# Altium schematic sheet AC mains Sensing.SchDoc
size A3
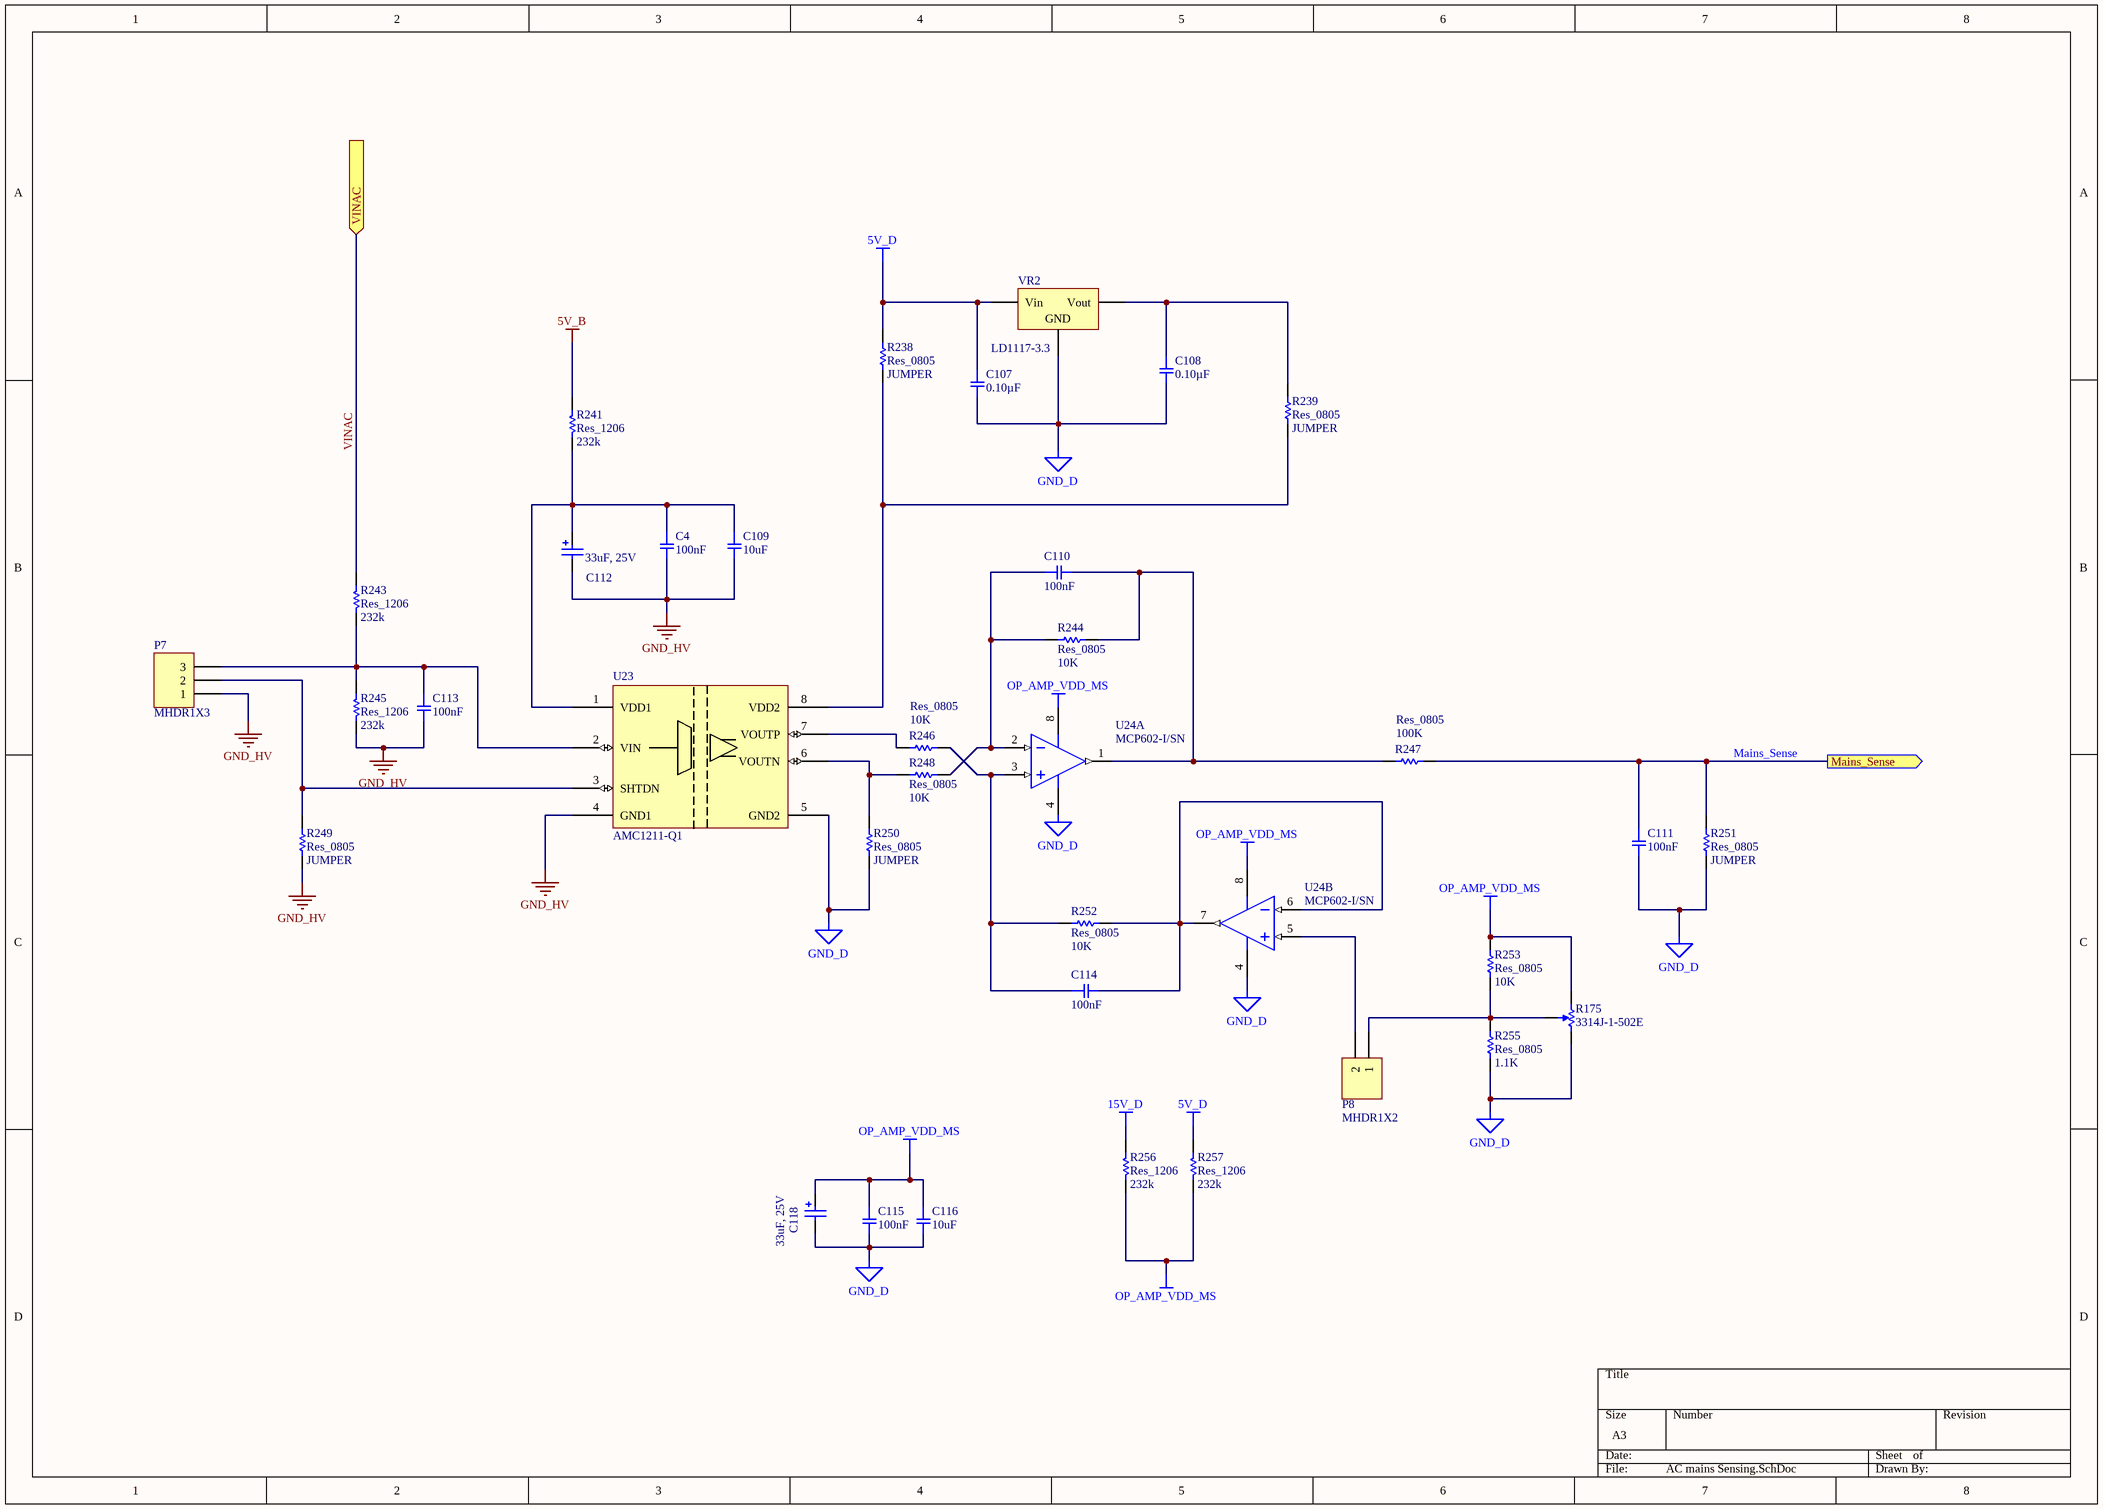
[diagram p0: AC mains Sensing.SchDoc]

## Parts
C4  100nF  [SMD-0805C]
C107  0.10µF  [SMD-0805C]
C108  0.10µF  [SMD-0805C]
C109  10uF  [SMD-0805C]
C110  100nF  [SMD-0805C]
C111  100nF  [SMD-0805C]
C112  33uF, 25V  [WCAP-ASLL_6.3x5.5]
C113  100nF  [SMD-0805C]
C114  100nF  [SMD-0805C]
C115  100nF  [SMD-0805C]
C116  10uF  [SMD-0805C]
C118  33uF, 25V  [WCAP-ASLL_6.3x5.5]
P7  MHDR1X3  [MHDR1X3]
P8  MHDR1X2  [61900211121]
R175  3314J-1-502E  [BOUR-3314J-1_V]
R238  Res_0805  value JUMPER  [WRIS-KSKE_0805_H=0.6mm]
R239  Res_0805  value JUMPER  [WRIS-KSKE_0805_H=0.6mm]
R241  Res_1206  value 232k  [WRIS-KSKE_1206_H=0.6mm]
R243  Res_1206  value 232k  [WRIS-KSKE_1206_H=0.6mm]
R244  Res_0805  value 10K  [WRIS-KSKE_0805_H=0.6mm]
R245  Res_1206  value 232k  [WRIS-KSKE_1206_H=0.6mm]
R246  Res_0805  value 10K  [WRIS-KSKE_0805_H=0.6mm]
R247  Res_0805  value 100K  [WRIS-KSKE_0805_H=0.6mm]
R248  Res_0805  value 10K  [WRIS-KSKE_0805_H=0.6mm]
R249  Res_0805  value JUMPER  [WRIS-KSKE_0805_H=0.6mm]
R250  Res_0805  value JUMPER  [WRIS-KSKE_0805_H=0.6mm]
R251  Res_0805  value JUMPER  [WRIS-KSKE_0805_H=0.6mm]
R252  Res_0805  value 10K  [WRIS-KSKE_0805_H=0.6mm]
R253  Res_0805  value 10K  [WRIS-KSKE_0805_H=0.6mm]
R255  Res_0805  value 1.1K  [WRIS-KSKE_0805_H=0.6mm]
R256  Res_1206  value 232k  [WRIS-KSKE_1206_H=0.6mm]
R257  Res_1206  value 232k  [WRIS-KSKE_1206_H=0.6mm]
U23  AMC1211-Q1  [SOIC127P570X175_HS-9N - No Thermal]
U24  MCP602-I/SN  [SOIC127P570X175_HS-9N - No Thermal]  (parts A,B of 2)
VR2  LD1117-3.3  [SOT230P700X180-4N]

## Ports
Mains_Sense (out), VINAC (in)

## Nets
5V_B: R241.2
5V_D: C107.1 R238.1 R257.2 VR2.3(Vin)
15V_D: R256.2
GND_D: C107.2 C108.2 C111.2 C115.2 C116.2 C118.1(N) R175.3 R250.2 R251.2 R255.2 U23.5(GND2) U24.4(VSS) VR2.1(GND)
GND_HV: C4.2 C109.2 C112.1(N) C113.2 P7.1 R245.1 R249.2 U23.4(GND1)
OP_AMP_VDD_MS: C115.1 C116.1 C118.2(P) R175.1 R253.1 R256.1 R257.1 U24.8(VDD)
Mains_Sense: C111.1 R247.2 R251.1 ; port Mains_Sense
VINAC: R243.2 ; port VINAC
NetC4_1: C4.1 C109.1 C112.2(P) R241.1 U23.1(VDD1)
NetC108_1: C108.1 R239.1 VR2.2(Vout)
NetC110_1: C110.1 R244.1 R248.2 U24.2(VINA-)
NetC110_2: C110.2 R244.2 R247.1 U24.1(VOUTA)
NetC113_1: C113.1 P7.3 R243.1 R245.2 U23.2(VIN)
NetC114_1: C114.1 R246.2 R252.1 U24.3(VINA+)
NetC114_2: C114.2 R252.2 U24.6(VINB-) U24.7(VOUTB)
NetP7_2: P7.2 R249.1 U23.3(SHTDN)
NetP8_1: P8.1 R175.2 R253.2 R255.1
NetP8_2: P8.2 U24.5(VINB+)
NetR238_2: R238.2 R239.2 U23.8(VDD2)
NetR246_1: R246.1 U23.7(VOUTP)
NetR248_1: R248.1 R250.1 U23.6(VOUTN)

## Library data of the parts
C4 C109-C111 C113-C116 = GC321AD72E103KX01D: CAP CER 10000PF 250V X7T 0805; Manufacturer: Murata Electronics North America; Factory Stock: 0; Unit Price (USD): 0.3; Minimum Quantity: 1; Tolerance: ±10%; Datasheets: http://search.murata.co.jp/Ceramy/image/img/A01X/G101/ENG/GC321AD72E103KX01-01.pdf; Image: //media.digikey.com/Renders/Murata%20Renders/0805(GC3)200x125.jpg; Digi-Key Part Number: 490-13986-1-ND; Part Number: GC321AD72E103KX01D; Quantity Available: 4000; @ qty: 0; Packaging: Cut Tape (CT); Series: GC3; Part Status: Active; Voltage: 250V; Temperature Coefficient: X7T; Operating Temperature: -55°C ~ 125°C; Features: -; Ratings: AEC-Q200; Applications: Automotive; Mounting Type: Surface Mount, MLCC; Package / Case: 0805 (2012 Metric); Size / Dimension: 0.079" L x 0.049" W (2.00mm x 1.25mm); Height - Seated (Max): -; Thickness (Max): 0.039" (1.00mm); Lead Spacing: -; Lead Style: -
  C4 C110 C111 C113-C115: Value: 100nF
  C109 C116: Value: 10uF
C107 C108 = GCD21BR71H104KA01L: CAP CER 0.1UF 50V X7R 0805; Manufacturer: Murata Electronics North America; Factory Stock: 0; Unit Price (USD): 0.24; Minimum Quantity: 1; Tolerance: ±10%; Datasheets: http://www.murata.com/~/media/webrenewal/support/library/catalog/products/capacitor/mlcc/c03e.ashx; Image: //media.digikey.com/Renders/Murata%20Renders/0805%28GxM6%29.jpg; Digi-Key Part Number: 490-11955-1-ND; Part Number: GCD21BR71H104KA01L; Quantity Available: 157; @ qty: 0; Packaging: Cut Tape (CT); Series: GCD; Part Status: Active; Value: 0.10µF; Voltage: 50V; Temperature Coefficient: X7R; Operating Temperature: -55°C ~ 125°C; Features: -; Ratings: AEC-Q200; Applications: Automotive; Mounting Type: Surface Mount, MLCC; Package / Case: 0805 (2012 Metric); Size / Dimension: 0.079" L x 0.049" W (2.00mm x 1.25mm); Height - Seated (Max): -; Thickness (Max): 0.049" (1.25mm); Lead Spacing: -; Lead Style: -
C112 C118 = 865060443003: WCAP-ASLL SMT Aluminum Electrolytic Capacitors, D6.3mm x L5.5mm, 33uF, +/-20%, 25VDC; Dissipation Factor: 14%; Endurance: 2000h; Leakage Current: 8.25uA; Ripple Current max.: 230mA; Technical Reference: ASED055330M025DVCTBB000; ComponentLink1Description: Manufacturer; ComponentLink1URL: http://www.we-online.de; ComponentLink2Description: Datasheet; ComponentLink2URL: https://katalog.we-online.com/pbs/datasheet/865060443003.pdf; Length: 5.5mm; Mounting Technology: SMT; Operating Temperature: -55 to +105degC; Packaging: Tape and Reel; Published Date: August 2019; Capacitance: 33uF; Diameter: 6.3mm; Part Number: 865060443003; Publisher: Wurth Elektronik; Capacitance Tolerance: +/-20%; Rated Voltage: 25VDC
P7 = MHDR1X3: Header, 3-Pin; LatestRevisionDate: 17-Jul-2002; LatestRevisionNote: Re-released for DXP Platform.; Publisher: Altium Limited
P8 = MHDR1X2: Header, 2-Pin; LatestRevisionDate: 17-Jul-2002; LatestRevisionNote: Re-released for DXP Platform.; Publisher: Altium Limited
R175 = CMP-2000-05590-1: 4 mm Square Trimpot(R) Trimming Potentiometer, 5 KOhm, +/- 20%, 0.25 W, -55 to 125 degC, 3-Pin SMD, RoHS, Tape and Reel; Manufacturer: Bourns; Power: 250; Angle of rotation: 240°; Resistance: 5; Curve: linear; Package Description: 3-Pin Surface Mount Device, Body 4.5 x 4.5 mm, Pitch 1.15 mm; Mounting Technology: SurfaceMount; Package Reference: 3314J-1; Package: J-lead; Manufacturer URL: http://www.bourns.com/; Datasheet Version: 05/2016; Tolerance: ±20%; Temperature range: -55...+125°C; Datasheet URL: http://www.bourns.com/docs/Product-Datasheets/3314.pdf
R238 R239 R241 R243-R253 R255-R257 = Res1: Resistor; Published: 8-Jun-2000; LatestRevisionDate: 17-Jul-2002; LatestRevisionNote: Re-released for DXP Platform.; PackageReference: AXIAL-0.3; Publisher: Altium Limited; PackageDescription: Axial Device, Thru-Hole; 2 Leads; 0.3 in Pin Spacing
U24 = MCP602_2: 2.7V to 6.0V Single Supply CMOS Operational Amplifier, 8-Pin SOIC, Industrial Temperature; ComponentLink1URL: http://www.microchip.com/; ComponentLink1Description: Manufacturer URL; RevisionNote: URLs added.; PackageReference: SOIC-SN8; ComponentLink2URL: http://ww1.microchip.com/downloads/en/DeviceDoc/21314g.pdf; ComponentLink3URL: http://www.microchip.com/stellent/groups/techpub_sg/documents/packagingspec/en012702.pdf; PackageDescription: 8-Lead Plastic Small Outline (SN) - Narrow, 3.90mm Body [SOIC]; DatasheetVersion: revG, Dec-2007; ComponentLink2Description: Datasheet; ComponentLink3Description: Package Specification; Code_IPC: SOIC127P600-8; Code_JEDEC: MS-012; PackageVersion: revBB, Aug-2009
VR2 = LD117-3.3: Voltage Regulator; Published: 24-Mar-1999; LatestRevisionDate: 29-May-2009; LatestRevisionNote: IPC-7351 Footprint Added.; PackageReference: D2PAK; Publisher: Altium Limited; PackageDescription: 3-Pin Transistor Outline Package 2.54 mm Pitch, 15.1 mm Lead Span